# EAGLE schematic ShieldDino (EAGLE 9.1.3)
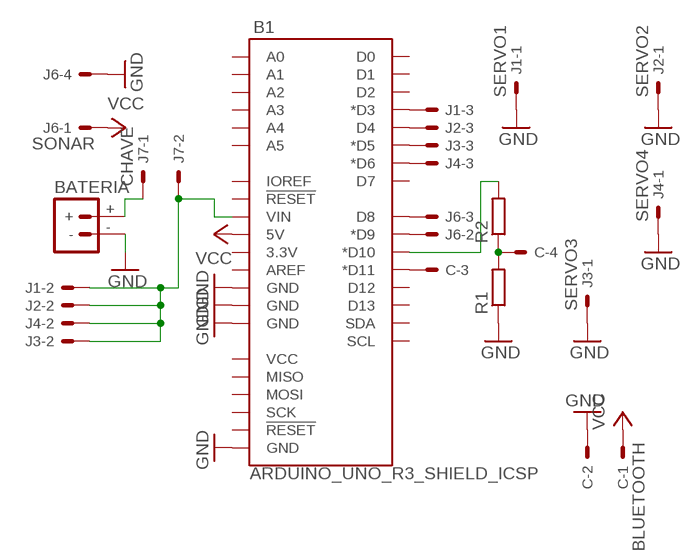
[diagram p0: schematic, sheet 1]

## Parts
B1  ARDUINO_UNO_R3_SHIELD_ICSP  [UNO_R3_SHIELD_ICSP]
BATERIA  BATTERY_CONNXT60  [XT60]
C  BLUETOOTH  CONN_0427-2041  [6410-04]
J1  SERVO1  CONN_0327-2031  [6410-03]
J2  SERVO2  CONN_0327-2031  [6410-03]
J3  SERVO3  CONN_0327-2031  [6410-03]
J4  SERVO4  CONN_0327-2031  [6410-03]
J6  SONAR  CONN_0427-2041  [6410-04]
J7  CHAVE  CONN_0227-2021  [6410-02]
R1  R-EU_0204/7  [0204/7]
R2  R-EU_0204/7  [0204/7]

## Nets
GND: B1.GND@0(GND) B1.GND@1(GND) B1.GND@2(GND) B1.GND_ICSP(GND) BATERIA.- C.2 J1.1 J2.1 J3.1 J4.1 J6.4 R1.1
N$1: B1.D11(*D11) C.3
N$2: B1.D10(*D10) R2.2
N$3: B1.D3(*D3) J1.3
N$4: B1.D4 J2.3
N$5: B1.D5(*D5) J3.3
N$6: B1.D6(*D6) J4.3
N$7: BATERIA.+ J7.1
N$8: B1.D9(*D9) J6.2
N$9: B1.D8 J6.3
N$10: B1.VIN J1.2 J2.2 J3.2 J4.2 J7.2
N$11: C.4 R1.2 R2.1
VCC: B1.5V C.1 J6.1
Unconnected: B1.3.3V B1.5V_ICSP(VCC) B1.A0 B1.A1 B1.A2 B1.A3 B1.A4 B1.A5 B1.AREF B1.D2 B1.D7 B1.D12 B1.D13 B1.IOREF B1.MISO B1.MOSI B1.RES(!RESET!) B1.RST_ICSP(!RESET!) B1.RX(D0) B1.SCK B1.SCL B1.SDA B1.TX(D1)

## Library data of the parts
B1 = Robotica-IFRN-SC-Arduino:ARDUINO_UNO_R3_SHIELD_ICSP: Arduino R3 Shield Footprint with ICSP Header Includes pins for 6-pin (2x3) ICSP Header. Compatible with Leonardo boards that require SPI pin connections via this header. SparkFun Products: CryptoShield <https://www.sparkfun.com/products/13183> microSD Shield <https://www.sparkfun.com/products/12761> R3 Stackable Headers Kit <https://www.sparkfun.com/products/1417>
BATERIA = Robotica-IFRN-SC-conectores:BATTERY_CONN: Battery Connectors Various footprints for battery connections
C J6 = Robotica-IFRN-SC-conectores:CONN_04: CONNECTOR wire to board 2.54 mm (.1 inch) pitch header; OC_FARNELL: unknown; OC_NEWARK: unknown
J1-J4 = Robotica-IFRN-SC-conectores:CONN_03: CONNECTOR wire to board 2.54 mm (.1 inch) pitch header; OC_FARNELL: unknown; OC_NEWARK: unknown
J7 = Robotica-IFRN-SC-conectores:CONN_02: CONNECTOR wire to board 2.54 mm (.1 inch) pitch header; OC_FARNELL: unknown; OC_NEWARK: unknown
R1 R2 = rcl:R-EU_: RESISTOR, European symbol